# EAGLE board Debug Tester rev B (EAGLE 9.7.0)
REV: A
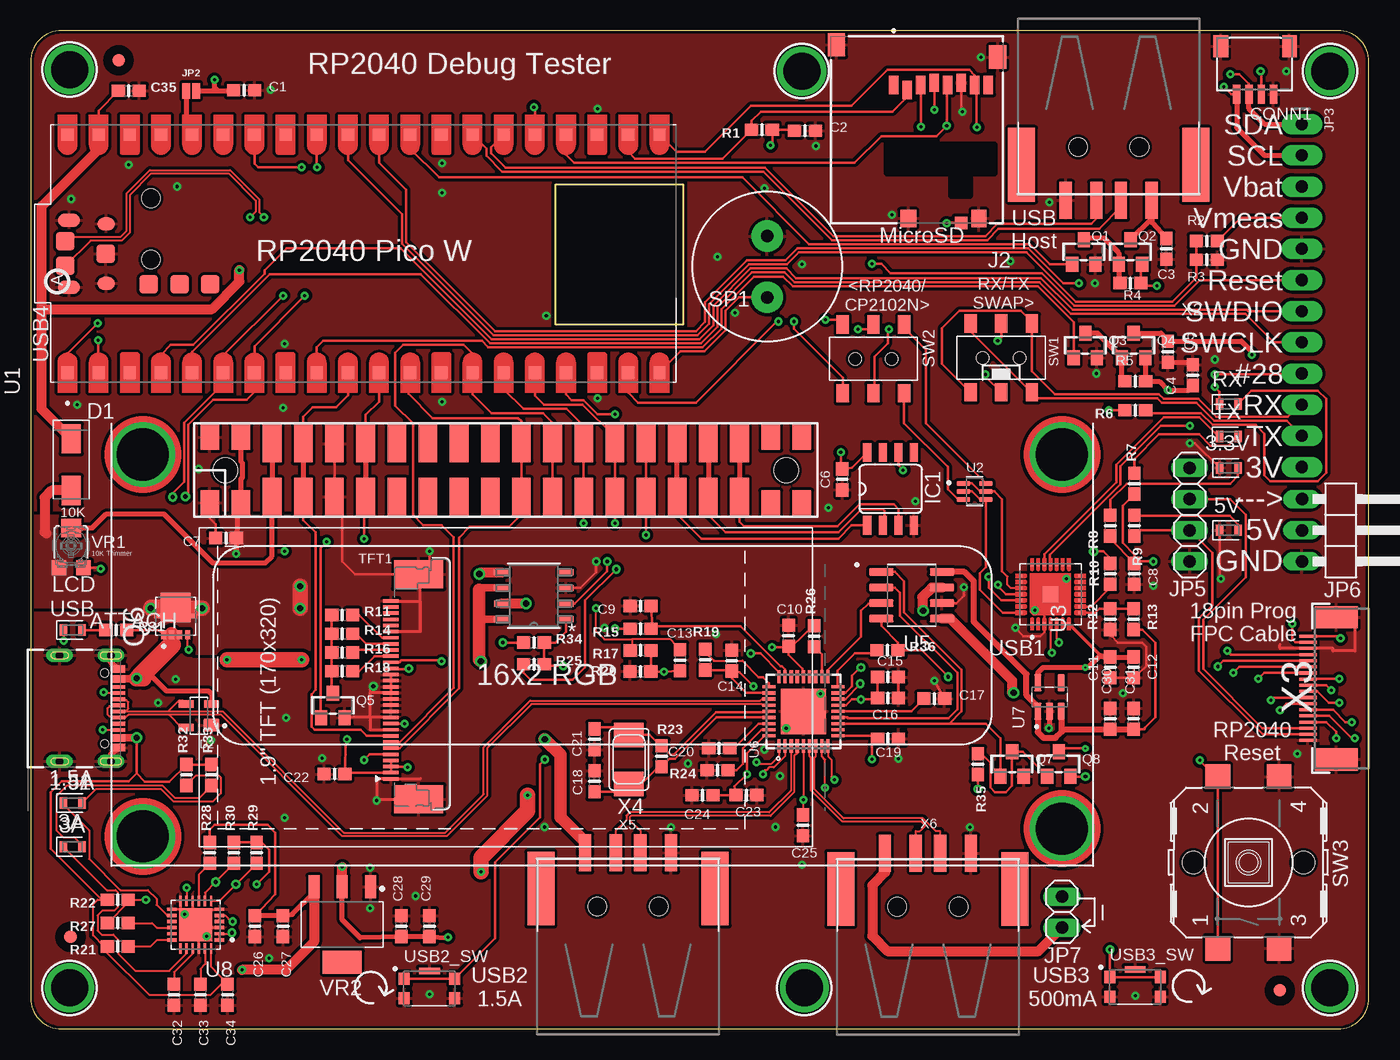
[diagram p2: board, top side]
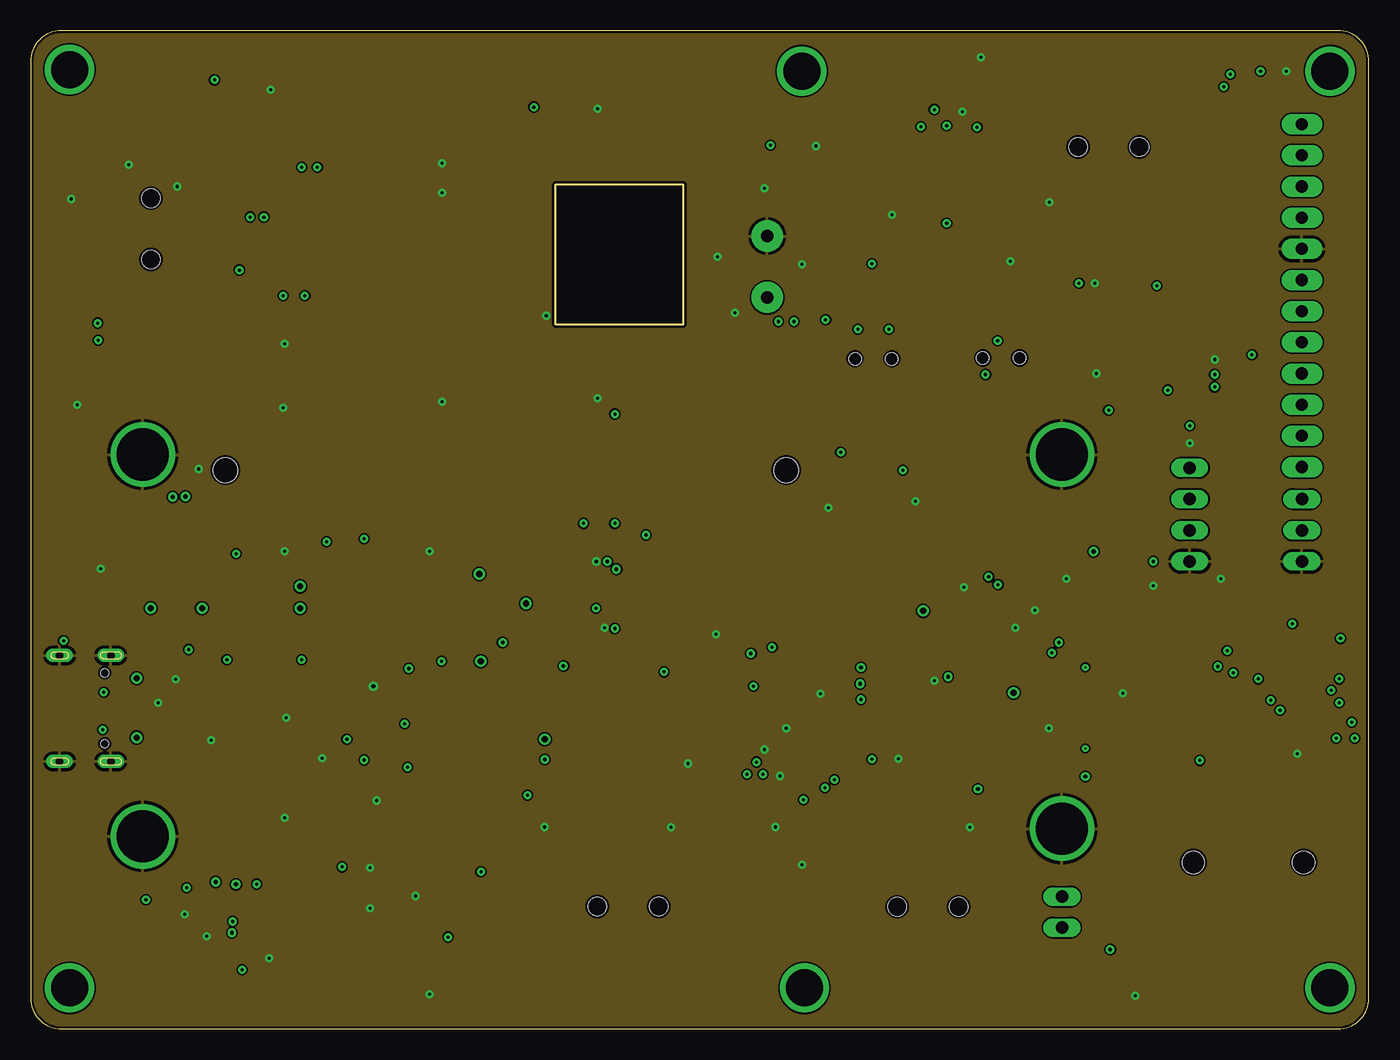
[diagram p3: board, inner layer Route2]
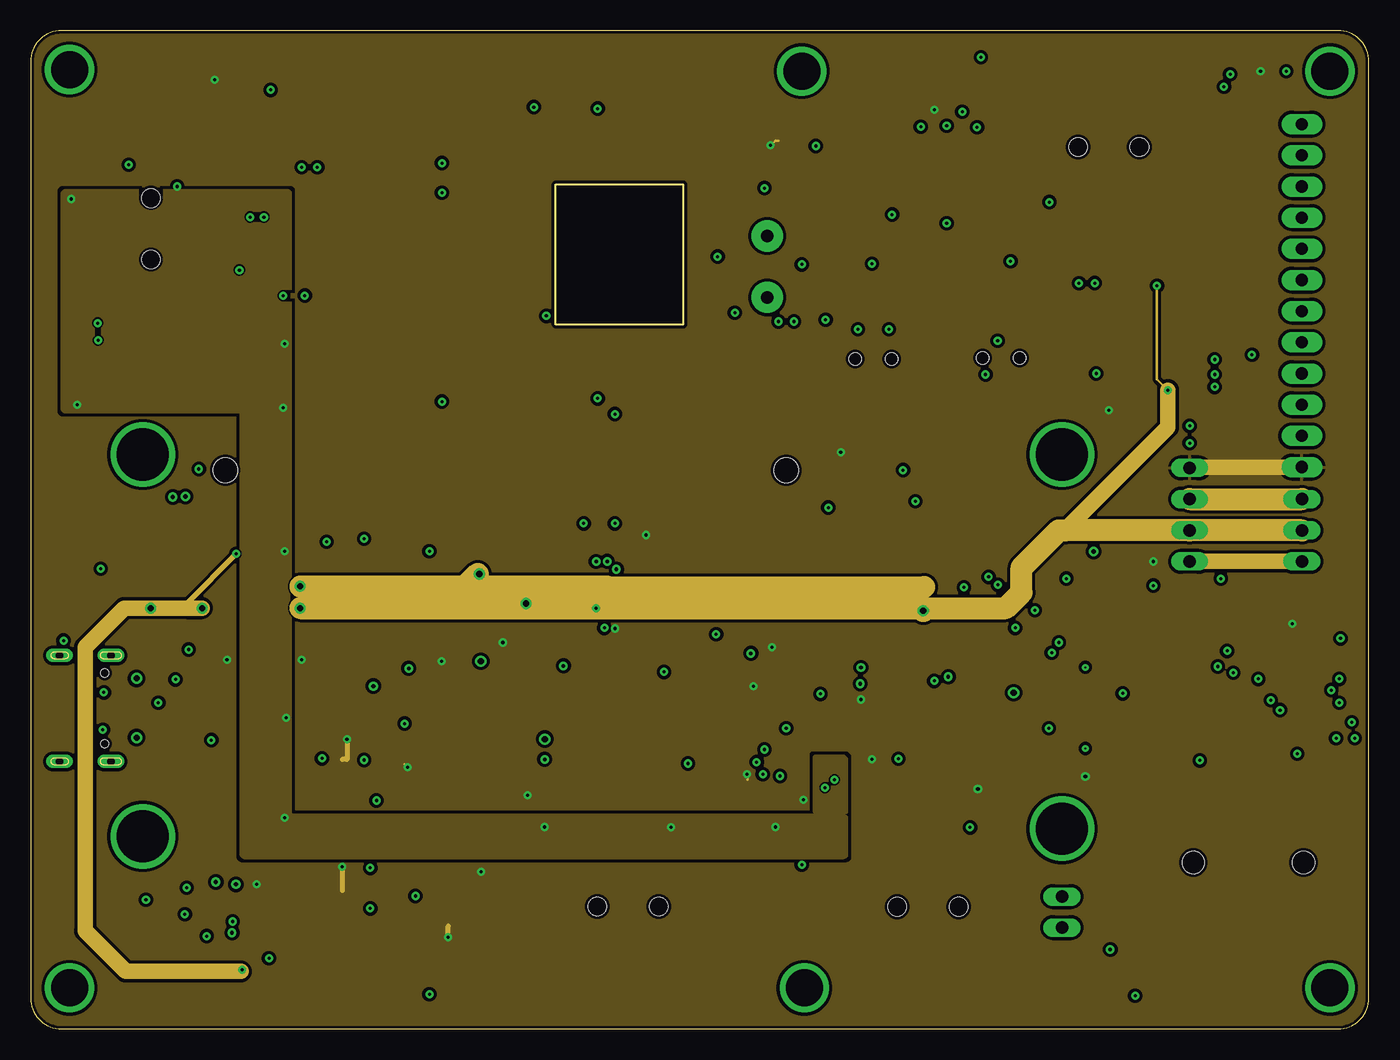
[diagram p4: board, inner layer Route15]
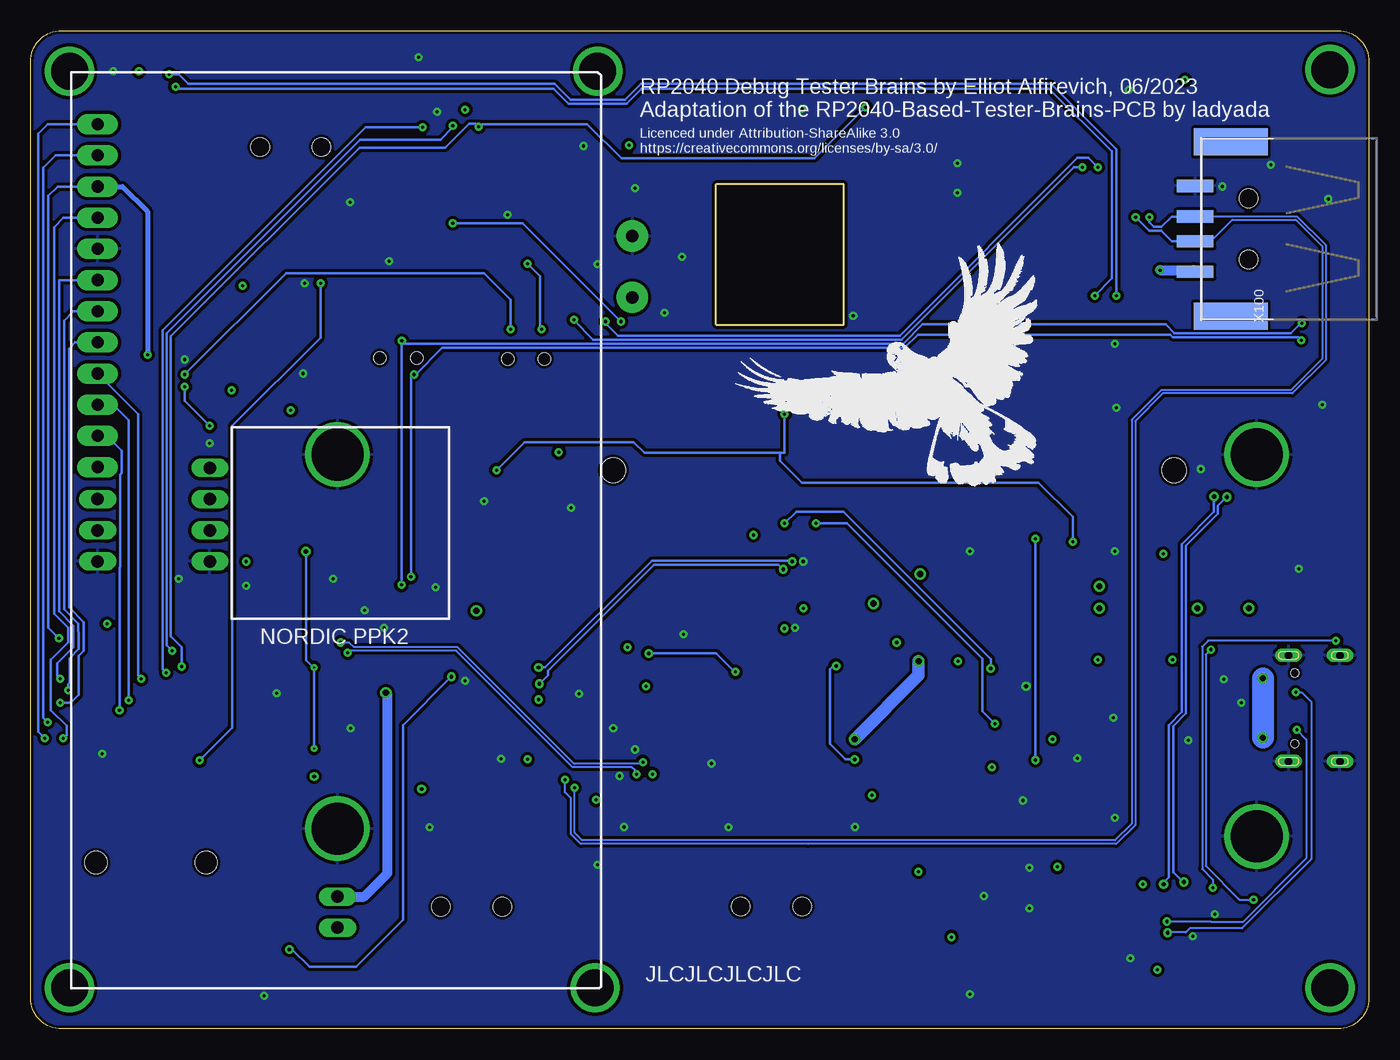
[diagram p5: board, bottom side, seen from below]

Size 109.09 x 81.35 mm. Coordinates in mm from the lower left corner, seen from the top.
Outline: 106.59,81.35 2.5,81.35 arc90 0,78.85 0,2.5 arc90 2.5,0 106.59,0 arc90 109.09,2.5 109.09,78.85 arc90 106.59,81.35
Outline: 53.21,57.4 42.8,57.4 42.8,68.83 53.21,68.83 53.21,57.4
Copper layers (1+2*15+16): Top 0.035mm / dielectric 1.5mm / Route2 0.035mm / dielectric 0.15mm / Route15 0.035mm / dielectric 0.2mm / Bottom 0.035mm
Design rules "adafruit 8-8 *": minimum track width 5mil, minimum drill 0.15mm, track to track 5mil, track to pad 0.2mm, pad to pad 0.2mm, via to via 0.2mm, smd to smd 0.2mm, copper to edge 0.2mm, drill to drill 0.5mm, minimum pad ring 10mil, minimum via ring 8mil, stop-mask expansion 2mil, vias tented up to drill 20mil, thermal gap 10mil
Net classes: 1 power: width 0.254 mm; 2 USB2: width 0.152 mm, clearance 0.127 mm

## Footprints (pad centres in the part's own frame; a part is rotated, then mirrored left to right if it is on the bottom)
LEDC1608X55N_FLAT-B = smd 0.612 x 0.912: A 0.75,0; C -0.75,0
MOUNTINGHOLE_3.0_PLATEDTHIN = drill 3 pad 3.6: P$1 0,0
0603-NO = smd 1.075 x 1: 1 -0.85,0; 2 0.85,0
JST_SH4 = smd 0.6 x 1.55: 1 -1.5,2.006; 2 -0.5,2.006; 3 0.5,2.006; 4 1.5,2.006 | smd 1.2 x 1.8: MT1 -2.8,-1.894; MT2 2.8,-1.894
DIOM5226X290N = smd 2.392 x 1.565: 1 -2.108,0; 2 2.108,0
SOT143 = smd 0.99 x 1.3: 1 -0.76,-1.025 | smd 0.59 x 1.3: 2 0.96,-1.025; 3 0.96,1.025; 4 -0.96,1.025
FIDUCIAL_1MM = smd 1 x 1: 1 0,0
SO08-SKINNYPADS = smd 0.66 x 1.524: 1 -1.905,-2.973; 2 -0.635,-2.973; 3 0.635,-2.973; 4 1.905,-2.973; 5 1.905,2.973; 6 0.635,2.973; 7 -0.635,2.973; 8 -1.905,2.973
GCT_USB4105_REVA = smd 0.6 x 1.15: A1/B12 -3.2,4.755; A4/B9 -2.4,4.755; B1/A12 3.2,4.755; B4/A9 2.4,4.755 | smd 0.3 x 1.15: A5 -1.25,4.755; A6 -0.25,4.755; A7 0.25,4.755; A8 1.25,4.755; B5 1.75,4.755; B6 0.75,4.755; B7 -0.75,4.755; B8 -1.75,4.755 | drill 0.6 pad 1 long: G1 -4.32,0; G2 4.32,0 | drill 0.6 pad 1.05 long: G3 -4.32,4.18; G4 4.32,4.18 | hole 0.65: 2.89,3.68; -2.89,3.68
GCT_MEM2052-00-195-00-A_REVA = smd 1.4 x 1.9: G1 -6.575,-5.925; G2 6.575,-6.925 | smd 1.2 x 1.4: G3 -5.035,7.225 | smd 1.3 x 1.4: G4 0.715,7.225 | smd 0.8 x 1.5: P1 1.905,-3.635; P2 0.805,-3.235; P3 -0.295,-3.635; P4 -1.395,-3.835; P5 -2.495,-3.635; P6 -3.595,-3.835; P7 -4.695,-3.635; P8 -5.795,-3.635 | smd 1 x 1.04: P9 -3.585,7.595
SMT-JUMPER_2_NO_NO-SILK = smd 0.635 x 1.27: 1 -0.406,0; 2 0.406,0
1X12_OVAL = drill 1 pad 1.676 long: 1 -13.97,0; 2 -11.43,0; 3 -8.89,0; 4 -6.35,0; 5 -3.81,0; 6 -1.27,0; 7 1.27,0; 8 3.81,0; 9 6.35,0; 10 8.89,0; 11 11.43,0; 12 13.97,0
2X20_SMT_MALE = smd 1.524 x 2.032: 1 -24.13,-2.667; 2 -24.13,2.667; 3 -21.59,-2.667; 4 -21.59,2.667; 37 21.59,-2.667; 38 21.59,2.667; 39 24.13,-2.667; 40 24.13,2.667 | smd 1.524 x 3.048: 5 -19.05,-2.159; 6 -19.05,2.159; 7 -16.51,-2.159; 8 -16.51,2.159; 9 -13.97,-2.159; 10 -13.97,2.159; 11 -11.43,-2.159; 12 -11.43,2.159; 13 -8.89,-2.159; 14 -8.89,2.159; 15 -6.35,-2.159; 16 -6.35,2.159; 17 -3.81,-2.159; 18 -3.81,2.159; 19 -1.27,-2.159; 20 -1.27,2.159; 21 1.27,-2.159; 22 1.27,2.159; 23 3.81,-2.159; 24 3.81,2.159; 25 6.35,-2.159; 26 6.35,2.159; 27 8.89,-2.159; 28 8.89,2.159; 29 11.43,-2.159; 30 11.43,2.159; 31 13.97,-2.159; 32 13.97,2.159; 33 16.51,-2.159; 34 16.51,2.159; 35 19.05,-2.159; 36 19.05,2.159 | hole 2: -22.86,0; 22.86,0
1X04 = drill 1.016 long: 1 -3.81,0; 2 -1.27,0; 3 1.27,0; 4 3.81,0
1X03/90 = drill 1.016 long: 1 -2.54,-3.81; 2 0,-3.81; 3 2.54,-3.81
1X02 = drill 1.016 long: 1 -1.27,0; 2 1.27,0
SOT23-WIDE = smd 1 x 1.2: 1 -0.95,-1; 2 0.95,-1; 3 0,1
TRANS_STL9P3LLH6 = smd 0.75 x 0.4: 1 -1.525,0.975; 2 -1.525,0.325; 3 -1.525,-0.325; 4 -1.525,-0.975 | smd 2.4 x 2.45: 5 0.7,0 | smd 0.4 x 0.53: 5_1 0,1.49; 5_2 0,-1.49
PS12 = drill 1 pad 2.54: P$1 -2.5,0; P$2 2.5,0
EG1390 = smd 1 x 1.5: O1 -2.5,2.8; O2 -2.5,-2.8; P1 0,2.8; P2 0,-2.8; S1 2.5,2.8; S2 2.5,-2.8 | hole 1: 1.5,0; -1.5,0
B3F-40XX-SMT = smd 2 x 2: P$1 -7,2.5; P$2 7,2.5; P$3 -7,-2.5; P$4 7,-2.5 | hole 1.803: 0,-4.496; 0,4.496
TFT_1.9IN_170X320_30P_SS = smd 0.28 x 1.25: 1 -7.25,1.236; 2 -6.75,1.236; 3 -6.25,1.236; 4 -5.75,1.236; 5 -5.25,1.236; 6 -4.75,1.236; 7 -4.25,1.236; 8 -3.75,1.236; 9 -3.25,1.236; 10 -2.75,1.236; 11 -2.25,1.236; 12 -1.75,1.236; 13 -1.25,1.236; 14 -0.75,1.236; 15 -0.25,1.236; 16 0.25,1.236; 17 0.75,1.236; 18 1.25,1.236; 19 1.75,1.236; 20 2.25,1.236; 21 2.75,1.236; 22 3.25,1.236; 23 3.75,1.236; 24 4.25,1.236; 25 4.75,1.236; 26 5.25,1.236; 27 5.75,1.236; 28 6.25,1.236; 29 6.75,1.236; 30 7.25,1.236 | smd 2.3 x 4: MNT1 -8.92,-1.02; MNT2 9.42,-1.02
SMT_NUT_3MM = drill 4.25 pad 4.572: P$1 0,0
MODULE_SC0915 = smd 1 x 1: 1 -9.69,24.13; 2 -9.69,21.59; 3 -9.69,19.05; 4 -9.69,16.51; 5 -9.69,13.97; 6 -9.69,11.43; 7 -9.69,8.89; 8 -9.69,6.35; 9 -9.69,3.81; 10 -9.69,1.27; 11 -9.69,-1.27; 12 -9.69,-3.81; 13 -9.69,-6.35; 14 -9.69,-8.89; 15 -9.69,-11.43; 16 -9.69,-13.97; 17 -9.69,-16.51; 18 -9.69,-19.05; 19 -9.69,-21.59; 20 -9.69,-24.13; 21 9.69,-24.13; 22 9.69,-21.59; 23 9.69,-19.05; 24 9.69,-16.51; 25 9.69,-13.97; 26 9.69,-11.43; 27 9.69,-8.89; 28 9.69,-6.35; 29 9.69,-3.81; 30 9.69,-1.27; 31 9.69,1.27; 32 9.69,3.81; 33 9.69,6.35; 34 9.69,8.89; 35 9.69,11.43; 36 9.69,13.97; 37 9.69,16.51; 38 9.69,19.05; 39 9.69,21.59; 40 9.69,24.13 | smd 1.1 x 1.8: A -2.725,24; B 2.725,24 | smd 1.05 x 1.45: C -2.425,20.97; D 2.425,20.97 | smd 1.5 x 1.5: TP1 0,21; TP2 1,24.3; TP3 -1,24.3; TP4 -2.5,17.5; TP5 -2.5,15; TP6 -2.5,12.5
SOP65P210X100-6N = smd 1.09 x 0.4: 1 -0.92,0.65; 2 -0.92,0; 3 -0.92,-0.65; 4 0.92,-0.65; 5 0.92,0; 6 0.92,0.65
IC_CP2102N-A02-GQFN28R = smd 0.25 x 0.25: 1 -2.4,1.5; 2 -2.4,1; 3 -2.4,0.5; 4 -2.4,0; 5 -2.4,-0.5; 6 -2.4,-1; 7 -2.4,-1.5; 8 -1.5,-2.4; 9 -1,-2.4; 10 -0.5,-2.4; 11 0,-2.4; 12 0.5,-2.4; 13 1,-2.4; 14 1.5,-2.4; 15 2.4,-1.5; 16 2.4,-1; 17 2.4,-0.5; 18 2.4,0; 19 2.4,0.5; 20 2.4,1; 21 2.4,1.5; 22 1.5,2.4; 23 1,2.4; 24 0.5,2.4; 25 0,2.4; 26 -0.5,2.4; 27 -1,2.4; 28 -1.5,2.4 | smd 1.27 x 1.27: 29 0,0
SOIC-8_M_MCH-L = smd 1.257 x 0.483: 1 -2.623,1.905; 2 -2.623,0.635; 3 -2.623,-0.635; 4 -2.623,-1.905; 5 2.623,-1.905; 6 2.623,-0.635; 7 2.623,0.635; 8 2.623,1.905
SOIC127P599X173-8N = smd 1.98 x 0.59: 1 -2.47,1.905; 2 -2.47,0.635; 3 -2.47,-0.635; 4 -2.47,-1.905; 5 2.47,-1.905; 6 2.47,-0.635; 7 2.47,0.635; 8 2.47,1.905
VQFN50P600X600X100-36N = smd 1.08 x 0.26: 1 -2.815,2; 2 -2.815,1.5; 3 -2.815,1; 4 -2.815,0.5; 5 -2.815,0; 6 -2.815,-0.5; 7 -2.815,-1; 8 -2.815,-1.5; 9 -2.815,-2; 19 2.815,-2; 20 2.815,-1.5; 21 2.815,-1; 22 2.815,-0.5; 23 2.815,0; 24 2.815,0.5; 25 2.815,1; 26 2.815,1.5; 27 2.815,2 | smd 0.26 x 1.08: 10 -2,-2.815; 11 -1.5,-2.815; 12 -1,-2.815; 13 -0.5,-2.815; 14 0,-2.815; 15 0.5,-2.815; 16 1,-2.815; 17 1.5,-2.815; 18 2,-2.815; 28 2,2.815; 29 1.5,2.815; 30 1,2.815; 31 0.5,2.815; 32 0,2.815; 33 -0.5,2.815; 34 -1,2.815; 35 -1.5,2.815; 36 -2,2.815 | smd 3.7 x 3.7: 37 0,0
SOT95P280X145-5N = smd 1.39 x 0.58: 1 -1.165,0.95; 2 -1.165,0; 3 -1.165,-0.95; 4 1.165,-0.95; 5 1.165,0.95
QFN50P400X400X100-25N = smd 0.84 x 0.26: 1 -1.93,1.25; 2 -1.93,0.75; 3 -1.93,0.25; 4 -1.93,-0.25; 5 -1.93,-0.75; 6 -1.93,-1.25; 13 1.93,-1.25; 14 1.93,-0.75; 15 1.93,-0.25; 16 1.93,0.25; 17 1.93,0.75; 18 1.93,1.25 | smd 0.26 x 0.84: 7 -1.25,-1.93; 8 -0.75,-1.93; 9 -0.25,-1.93; 10 0.25,-1.93; 11 0.75,-1.93; 12 1.25,-1.93; 19 1.25,1.93; 20 0.75,1.93; 21 0.25,1.93; 22 -0.25,1.93; 23 -0.75,1.93; 24 -1.25,1.93 | smd 2.7 x 2.7: 25 0,0
SW_KMR421GULCLFS = smd 0.9 x 1: 1 -2.05,0.8; 2 -2.05,-0.8; 3 2.05,-0.8; 4 2.05,0.8 | smd 1.7 x 0.55: 5 0,1.425
TRIMPOT_BOURNS_TC33X-2 = smd 1.2 x 1.2: 1 -1,-1.8; 3 1,-1.8 | smd 1.6 x 1.5: 2 0,1.45
SOT230P700X170-4 = smd 1.86 x 0.898: 1 -3.075,2.3; 2 -3.075,0; 3 -3.075,-2.3 | smd 1.86 x 3.189: 4 3.075,0
USB_HOST-SMT = smd 1 x 3: D+ 1,0.495; D- -1,0.495; GND 3.5,0.495; VBUS -3.5,0.495 | smd 2.2 x 6: MT1 -7.1,-2.413; MT2 7.1,-2.413 | hole 1.5: -2.5,-3.863; 2.5,-3.863
FPC_0.5MM_18PIN = smd 0.25 x 1.4: 1 4.25,1.154; 2 3.75,1.154; 3 3.25,1.154; 4 2.75,1.154; 5 2.25,1.154; 6 1.75,1.154; 7 1.25,1.154; 8 0.75,1.154; 9 0.25,1.154; 10 -0.25,1.154; 11 -0.75,1.154; 12 -1.25,1.154; 13 -1.75,1.154; 14 -2.25,1.154; 15 -2.75,1.154; 16 -3.25,1.154; 17 -3.75,1.154; 18 -4.25,1.154 | smd 1.8 x 3.5: SUPPORT1 -5.8,-1.152; SUPPORT2 5.8,-1.152
NX5032 = smd 2 x 2.4: P$1 2,0; P$2 -2,0

## Placement (x,y rotation side)
1.5A  LED_BLUE  [LEDC1608X55N_FLAT-B]  3.43,18.41 0 top
3.3V  LED_BLUE  [LEDC1608X55N_FLAT-B]  97.68,45.71 0 top
3A  LED_BLUE  [LEDC1608X55N_FLAT-B]  3.42,14.85 0 top
5V  LED_BLUE  [LEDC1608X55N_FLAT-B]  97.68,40.63 0 top
$$U$1  MOUNTINGHOLE3.0THIN  [MOUNTINGHOLE_3.0_PLATEDTHIN]  3.17,78.18 0 top
$$U$2  MOUNTINGHOLE3.0THIN  [MOUNTINGHOLE_3.0_PLATEDTHIN]  62.87,78.05 0 top
$$U$3  MOUNTINGHOLE3.0THIN  [MOUNTINGHOLE_3.0_PLATEDTHIN]  105.92,78.05 0 top
$$U$4  [PCBFEAT-REV-040]  2.16,60.9 90 top
$$U$5  MOUNTINGHOLE3.0THIN  [MOUNTINGHOLE_3.0_PLATEDTHIN]  3.17,3.35 0 top
$$U$6  MOUNTINGHOLE3.0THIN  [MOUNTINGHOLE_3.0_PLATEDTHIN]  63.08,3.35 0 top
ATTACH  LED_BLUE  [LEDC1608X55N_FLAT-B]  3.43,32.5 0 top
C1  10uF  [0603-NO]  17.4,76.5 0 top
C2  10uF  [0603-NO]  63.12,73.19 0 top
C3  10uF  [0603-NO]  92.58,63.57 270 top
C4  10uF  [0603-NO]  92.71,55.19 270 top
C5  10uF  [0603-NO]  94.74,53.28 90 top
C6  10uF  [0603-NO]  66.17,44.77 270 top
C7  10uF  [0603-NO]  15.92,40 180 top
C8  10uF  [0603-NO]  89.97,37.08 270 top
C9  0.1uF  [0603-NO]  49.73,34.46 180 top
C10  0.1uF  [0603-NO]  61.79,32.05 90 top
C11  0.1uF  [0603-NO]  88.01,29.46 270 top
C12  10uF  [0603-NO]  89.92,29.46 270 top
C13  1uF  [0603-NO]  52.93,30.04 270 top
C14  0.1uF  [0603-NO]  57.16,30.01 90 top
C15  0.1uF  [0603-NO]  69.9,28.67 0 top
C16  4.7uF  [0603-NO]  69.9,26.97 0 top
C17  0.1uF  [0603-NO]  73.66,26.92 0 top
C18  12pf  [0603-NO]  45.97,23.59 270 top
C19  0.1uF  [0603-NO]  69.9,23.65 0 top
C20  0.1uF  [0603-NO]  56.13,22.86 180 top
C21  12pf  [0603-NO]  45.97,20.18 90 top
C22  10uF  [0603-NO]  24.77,20.77 180 top
C23  0.1uF  [0603-NO]  58.34,19.05 0 top
C24  4.7uF  [0603-NO]  54.78,19.03 180 top
C25  0.1uF  [0603-NO]  62.95,16.58 270 top
C26  4.7uF  [0603-NO]  18.29,8.37 270 top
C27  1uF  [0603-NO]  20.57,8.37 270 top
C28  10uF  [0603-NO]  30.23,8.37 90 top
C29  1uF  [0603-NO]  32.51,8.37 90 top
C30  0.1uF  [0603-NO]  88.01,25.27 90 top
C31  10uF  [0603-NO]  89.92,25.27 90 top
C32  1uF  [0603-NO]  11.68,2.79 270 top
C33  1uF  [0603-NO]  13.84,2.79 270 top
C34  1uF  [0603-NO]  16.05,2.79 270 top
C35  10uF  [0603-NO]  8,76.45 0 top
CONN1  STEMMA_I2C_QT  [JST_SH4]  99.82,78.18 180 top
D1  B140  [DIOM5226X290N]  3.3,45.99 270 top
D2  SP0503BAHTG  [SOT143]  13.72,25.52 90 top
FID1  FIDUCIAL_1MM  [FIDUCIAL_1MM]  7.16,78.94 0 top
FID2  FIDUCIAL_1MM  [FIDUCIAL_1MM]  3.25,7.5 0 top
FID3  FIDUCIAL_1MM  [FIDUCIAL_1MM]  101.84,3.13 0 top
IC1  WS2811-SOP8  [SO08-SKINNYPADS]  70.1,44.01 0 top
J1  USB4105_REVA  [GCT_USB4105_REVA]  2.36,26.12 270 top
J2  MEM2052-00-195-00-A_REVA  [GCT_MEM2052-00-195-00-A_REVA]  72.26,73.28 180 top
JP2  JUMPER-SMT_2_NC_PASTE_NO-SILK  [SMT-JUMPER_2_NO_NO-SILK]  13.08,76.45 0 top
JP3  [1X12_OVAL]  103.63,59.76 270 top
JP4  16x2 LCD  [2X20_SMT_MALE]  38.73,45.54 0 top
JP5  PINHD-1X4  [1X04]  94.49,41.9 90 top
JP6  PINHD-1X3/90  [1X03/90]  107.44,40.63 270 top
JP7  PINHD-1X2  [1X02]  84.07,9.52 270 top
Q1  BSS138  [SOT23-WIDE]  85.85,63.32 0 top
Q2  DMG34x5  [SOT23-WIDE]  89.66,63.32 0 top
Q3  BSS138  [SOT23-WIDE]  85.98,55.7 0 top
Q4  DMG34x5  [SOT23-WIDE]  89.92,55.7 0 top
Q5  BSS138  [SOT23-WIDE]  24.64,26.36 0 top
Q6  STL9P3LLH6  [TRANS_STL9P3LLH6]  11.81,33.65 90 top
Q7  BSS138  [SOT23-WIDE]  80.01,21.58 0 top
Q8  DMG34x5  [SOT23-WIDE]  83.82,21.58 0 top
R1  10K  [0603-NO]  59.61,73.27 180 top
R2  10K  [0603-NO]  95.89,64.2 0 top
R3  10K  [0603-NO]  95.89,62.68 180 top
R4  10K  [0603-NO]  89.66,60.78 0 top
R5  10K  [0603-NO]  90.04,52.77 0 top
R6  22K  [0603-NO]  90.04,50.41 180 top
R7  22K  [0603-NO]  89.97,44.44 270 top
R8  22K  [0603-NO]  88.01,41.01 270 top
R9  47K  [0603-NO]  89.97,41.01 270 top
R10  1K  [0603-NO]  88.01,37.08 90 top
R11  27  [0603-NO]  25.4,33.72 0 top
R12  47K  [0603-NO]  88.01,33.39 90 top
R13  22K  [0603-NO]  89.92,33.39 270 top
R14  27  [0603-NO]  25.4,32.2 0 top
R15  100K  [0603-NO]  49.73,32.61 180 top
R16  27  [0603-NO]  25.4,30.68 0 top
R17  100K  [0603-NO]  49.73,30.85 180 top
R18  27  [0603-NO]  25.4,29.15 0 top
R19  100K  [0603-NO]  54.99,30.09 90 top
R20  100K  [0603-NO]  49.71,29.13 0 top
R21  1K  [0603-NO]  7.11,6.72 180 top
R22  100K  [0603-NO]  7.11,10.53 180 top
R23  1M  [0603-NO]  51.43,22.22 270 top
R24  12K  [0603-NO]  56.01,21.07 180 top
R25  1K  [0603-NO]  41.02,29.71 0 top
R26  100K  [0603-NO]  63.88,32 90 top
R27  20K  [0603-NO]  7.11,8.63 180 top
R28  1K  [0603-NO]  14.61,14.34 90 top
R29  10K  [0603-NO]  18.41,14.34 90 top
R30  10K  [0603-NO]  16.57,14.34 90 top
R31  47K  [0603-NO]  6.99,32.5 0 top
R32  47K  [0603-NO]  12.7,20.69 90 top
R33  47K  [0603-NO]  14.73,20.69 90 top
R34  1K  [0603-NO]  41.02,31.49 0 top
R35  10K  [0603-NO]  77.22,21.58 270 top
R36  1K  [0603-NO]  69.85,30.85 0 top
RX  LED_BLUE  [LEDC1608X55N_FLAT-B]  97.66,50.92 0 top
SP1  SPEAKER/PS12  [PS12]  60.04,62.11 270 top
SW1  DPDT SLIDE  [EG1390]  79.12,54.68 180 top
SW2  [EG1390]  68.71,54.6 0 top
SW3  12mm SMT  [B3F-40XX-SMT]  99.28,13.56 90 top
TFT1  DISP_LCD_ST7789_1.9IN_SS  [TFT_1.9IN_170X320_30P_SS]  30.61,27.63 90 top
TP1  SEWTAP_SMTNUTM3  [SMT_NUT_3MM]  9.14,46.81 0 top
TP2  SEWTAP_SMTNUTM3  [SMT_NUT_3MM]  84.08,46.81 0 top
TP3  SEWTAP_SMTNUTM3  [SMT_NUT_3MM]  84.08,16.32 0 top
TP4  SEWTAP_SMTNUTM3  [SMT_NUT_3MM]  9.14,15.69 0 top
TX  LED_BLUE  [LEDC1608X55N_FLAT-B]  97.66,48.27 0 top
U1  SC0915  [MODULE_SC0915]  27.13,63.18 90 top
U2  UMH3NTN  [SOP65P210X100-6N]  76.96,43.81 0 top
U3  CP2102N-A02-GQFN28R  [IC_CP2102N-A02-GQFN28R]  83.14,35.42 90 top
U4  MIC2505-1YM-TRSOIC-8_M_MCH-L  [SOIC-8_M_MCH-L]  41.02,35.3 180 top
U5  MIC2026-1YM  [SOIC127P599X173-8N]  71.82,35.34 0 top
U6  USB2514B-AEZG  [VQFN50P600X600X100-36N]  63,25.88 90 top
U7  MIC5504-3.3YM5_TR  [SOT95P280X145-5N]  83.06,27.04 90 top
U8  STUSB4500LQTR  [QFN50P400X400X100-25N]  13.46,8.5 180 top
U$7  MOUNTINGHOLE3.0THIN  [MOUNTINGHOLE_3.0_PLATEDTHIN]  105.92,3.35 0 top
USB2_SW  KMR421GULCLFS  [SW_KMR421GULCLFS]  32.51,3.29 0 top
USB3_SW  KMR421GULCLFS  [SW_KMR421GULCLFS]  90.04,3.42 0 top
VR1  10K Trimmer  [TRIMPOT_BOURNS_TC33X-2]  3.3,39.38 0 top
VR2  NCP1117ST33T3G  [SOT230P700X170-4]  25.4,8.5 270 top
X2  USB A  [USB_HOST-SMT]  87.88,68.02 180 top
X3  TESTER_PROGCABLE_FLIP  [FPC_0.5MM_18PIN]  105.28,27.76 90 top
X4  24MHZ  [NX5032]  48.77,21.96 270 top
X5  USB A  [USB_HOST-SMT]  48.7,13.85 0 top
X6  USB A  [USB_HOST-SMT]  73.15,13.82 0 top
X100  USB A  [USB_HOST-SMT]  13.67,65.2 90 bottom

## Tracks (layer width: path | path; a pad name or v marks a point on that pad's centre or on a via)
3.3-RP2040
  Top 0.406: JP2.1 12.68,74.26 12.57,74.16 12.57,73.46 U1.36
3.3V  (via drill 0.25, 0.3)
  Top 0.152: U6.5 v63,18.66 62.95,18.61 C25.1
  Top 0.203: TFT1.4 TFT1.3 | TFT1.3 TFT1.2 25.82,20.88 C22.1 25.72,23.68 v25.78,23.61 | TFT1.3 30.68,21.38 v30.73,21.33 | TFT1.20 30.06,29.88 30.22,30.03 33.42,30.03 v33.49,29.96 | C15.1 C16.1 68.82,26.85 v67.69,26.85 66.94,26.85 66.48,26.38 U6.15 | U6.10 68.72,23.88 C19.1 68.58,23.18 v68.58,21.96 | U6.36 59.83,23.88 58.39,22.44 v58.39,20.77 57.39,19.77 C23.1 57.37,19.03 C24.1 | U6.29 58.33,27.38 57.16,28.56 C14.1 | v58.93,27.93 57.8,29.06 C14.1 | C10.1 61.79,30.5 62.93,29.36 62.93,28.76 U6.23 | C10.1 61.78,31.11 v60.45,31.11 | C2.1 62.19,73.27 R1.1 60.46,72.14 v60.32,72 | 73.67,74.94 v73.66,74.92 J2.P4 | CONN1.2 100.32,77.96 100.33,77.97 v100.27,78.03 | IC1.8 66.94,45.72 C6.1 66.04,45.85 v66.04,46.98 | X3.2 103.11,31.51 102.87,31.74 v102.87,33.01 | JP4.30 JP4.29 v50.16,40.25 | R15.2 47.65,32.61 v47.62,32.63 | R6.2 v87.88,50.41 | R8.2 88.01,39.98 C8.1 89.97,38.09 | R7.2 89.03,42.65 89.03,39.6 89.97,38.66 89.97,38.09 | v91.53,38.09 89.97,38.09 | R19.1 57.16,29.24 C14.1 | v18.41,11.8 19.43,12.82 19.43,14.6 18.84,15.19 R29.2 R30.2 | v77.22,19.55 R35.2 | v85.98,20.57 84.79,20.57 Q8.2 | v38.48,31.49 R34.1 | R26.2 63.8,32.85 62.05,31.2 C10.1
  Top 0.406: VR2.2 25.4,8.88 26.86,7.42 C28.1 C29.1 34.04,7.42 v34.04,7.49 | JP2.2 15.24,76.45 | 15.24,76.45 16.4,76.45 C1.1 | 15.24,76.45 14.99,76.7 v14.99,77.34
  Top 0.813: VR2.2 v25.4,13.2
  Top 1.27: v40.51,19.04 40.51,17.77 36.7,13.96 v36.7,12.82 | v22.1,30.09 v16,30.09
  Route15 0.203: v30.73,21.33 30.48,21.58 | v58.39,20.77 58.42,20.74 58.42,20.31 | v60.32,72 60.71,72.38 60.96,72.38
  Route15 0.406: v34.04,7.49 34.04,8.37 | v25.78,23.61 25.78,21.96 25.4,21.96 | v25.4,13.2 25.4,11.3
  Route15 1.27: JP5.4 94.57,45.79 JP3.12
  pour Route15 (isolate 0.254, rank 2): 0.13,0.12 109.09,0.12 109.09,81.15 0.13,81.15
3V_CP  (via drill 0.15, 0.35)
  Top 0.203: Q8.3 84.09,22.85 v85.98,22.85 | R10.2 88.01,38.36 87.46,38.91 v86.65,38.91
  Top 0.305: 87.26,30.41 U3.7 U3.6
  Top 0.406: C12.1 C11.1 87.26,30.41 | U7.5 82.11,29.01 82.55,29.46 v85.98,29.46 86.23,29.46 87.18,30.41
  Top 0.508: 87.18,30.41 C11.1
  Bottom 0.203: 85.98,29.39 v85.98,22.85 | 85.98,29.39 v85.98,29.46 | v86.65,38.91 86.65,30.06 85.98,29.39
!VBAT_SW1
  Top 0.406: R5.1 88.97,53 Q4.1 86.97,56.7 Q3.3
!VBAT_SW2
  Top 0.406: R4.1 88.71,60.88 Q2.1 88.71,63.25 87.52,64.44 85.98,64.44 Q1.3
+5V  (via drill 0.25, 0.5)
  Top 0.152: C13.1 52.18,31.74 49.02,31.74 | 49.02,31.74 49.02,30.98 R17.2 | 49.02,31.74 46.77,31.74 46.07,32.44 46.07,34.25 v46.1,34.28
  Top 0.203: v91.82,60.57 90.72,60.57 R4.2 90.51,62.22 Q2.2 | X3.17 100.45,24.01 95.25,29.2 95.25,33.48 96.31,34.54 96.31,38.81 JP5.2 90.44,40.63 R9.2 | C26.1 19.94,10.98 19.94,15.99 19.3,16.63 14.99,16.63 14.61,16.25 R28.2 | v17.23,4.82
  Top 0.406: JP4.4 17.14,46.25 17.28,46.12 17.28,44.95 17.14,44.82 JP4.3 16.87,42.6 C7.1 16.87,39.85 16.76,39.74 v16.76,38.73 | C5.1 94.47,52.06 v92.71,52.06 92,52.77 R5.2 90.89,54.67 Q4.2 | VR2.3 23.1,11.1 21.33,9.32 C27.1 C26.1
  Top 0.61: 36.7,37.2 v36.58,37.08
  Top 0.813: VR2.3 23.1,7.09 20.83,4.82 v17.23,4.82 | D1.2 1.73,43.88 1.14,43.3 1.14,40.5 1.27,40.38 | 36.7,37.2 U4.5 | v40.39,34.66 U4.7 | U5.7 73.46,35.97 72.7,35.2 72.7,34.2 72.76,34.13 v72.76,34.07
  Top 1.27: v21.97,36.06 v21.97,34.28 | v9.78,34.28 9.84,34.35 Q6.5 11.88,34.28 v13.97,34.28
  Route15 0.203: v92.71,52.06 91.82,52.95 v91.82,60.57 | 87.06,40.57 94.42,40.57 JP5.2 | v17.23,4.82 17.23,4.78 17.14,4.69
  Route15 0.406: v16.76,38.73 12.7,34.66 12.7,34.28
  Route15 0.61: v40.39,34.66 40.64,34.41 40.64,34.28
  Route15 1.27: v13.97,34.28 12.7,34.28 7.62,34.28 4.45,31.11 4.45,7.99 7.75,4.69 17.14,4.69 | v92.71,52.06 92.71,49.01 84.33,40.63 | 36.45,37.08 v36.58,37.08
  Route15 1.778: v21.97,34.28 40.64,34.28 v46.1,34.28 73.02,34.28 | 73.02,34.28 79.5,34.28 80.77,35.55 80.77,37.58 83.82,40.63 84.33,40.63 JP5.2 JP6.2 | v21.97,36.06 35.43,36.06 | 36.45,37.08 35.43,36.06 | 35.43,36.06 46.98,36.06 47.04,36 72.83,36 | 73.02,34.28 72.81,34.07 v72.76,34.07
  pour Top (isolate 0.254, no thermals): 9,33.08 9.02,33.04 9.02,31.79 10.21,30.6 22.73,30.6 22.73,41.77 0.13,41.77 0.13,34.41 7.65,34.41 7.69,34.39
BOOT-CP
  Top 0.203: U2.3 75.58,43.16 74.76,43.98 74.76,45.82 71.21,49.37 SW2.S2
CC1  (via drill 0.25, 0.3)
  Top 0.152: J1.A5 6.02,27.37 v5.97,27.42 | U8.2 15.44,7.71 16.29,7.71 v16.41,7.83
  Top 0.203: U8.2 U8.1
  Bottom 0.152: v5.97,27.42 5.46,27.42 4.7,26.66 4.7,13.84 10.34,8.19 14.61,8.19 14.94,7.87 16.38,7.87 v16.41,7.83
CC2  (via drill 0.25)
  Top 0.152: U8.4 U8.5 15.84,9.25 16.34,8.75 v16.47,8.75 | v5.88,24.37 J1.B5
  Bottom 0.152: v5.88,24.37 5.09,23.57 5.09,13.92 10.29,8.71 12.83,8.71 12.87,8.75 v16.47,8.75
D_N
  Top 0.152: 7.62,25.87 J1.A7 | 7.62,25.87 8.43,25.87 11.19,25.87 | U6.30 60.15,26.91 59.66,26.91 59.5,26.75 59.47,26.75 | 59.47,26.75 | J1.B7 7.19,26.8 7.81,26.8 7.97,26.64 7.97,26.11 7.81,25.95 7.62,25.95 7.62,25.87 | 11.19,25.87 15.65,25.87 25.53,15.99 33.79,15.99 36.93,19.13 36.93,22.97 40.72,26.75 59.47,26.75 | D2.3 12.44,26.73 12.06,26.73 11.19,25.87
D_P
  Top 0.152: U6.31 59.68,26.38 59.58,26.47 40.83,26.47 37.21,22.85 37.21,19.02 33.91,15.72 25.41,15.72 15.54,25.59 11.28,25.59 | J1.A6 7.12,26.3 6.43,26.3 6.27,26.14 6.27,25.61 6.43,25.45 7.12,25.45 J1.B6 7.72,25.37 7.79,25.45 7.81,25.45 7.95,25.59 11.28,25.59 | D2.4 12.31,24.56 11.28,25.59
DTR
  Top 0.203: U2.2 76.75,43.81 77.4,43.16 U2.4 77.88,37.61 77.39,37.12 77.39,35.79 79.27,33.92 U3.28
EN1
  Top 0.203: U6.12 74.67,24.88 74.89,24.88 | Q7.1 79.06,23.68 77.86,24.88 74.89,24.88 | 74.89,24.88 75.89,25.88 75.89,29.25 71.2,33.95 71.2,36.49 70.45,37.24 U5.1
EN2  (via drill 0.3)
  Top 0.203: U4.1 43.64,32.38 42.75,31.49 R34.2 R25.2 42,29.58 v43.43,29.58 | v41.91,21.96 41.53,21.58 41.53,17.26 37.85,13.58 37.85,7.38 USB2_SW.4 USB2_SW.1
  Bottom 0.203: v41.91,21.96 42.67,21.96 43.94,23.23 43.94,29.33 43.56,29.71 v43.43,29.58
EN3  (via drill 0.3)
  Top 0.203: U5.4 69.35,32.84 70.7,31.49 R36.2 72.64,30.85 v74.8,28.69 | v88.01,6.47 87.99,6.45 USB3_SW.1 USB3_SW.4
  Bottom 0.203: v74.8,28.69 78.74,24.76 78.74,8.88 82.55,5.07 86.36,5.07 87.76,6.47 v88.01,6.47
EN4
  Top 0.203: U6.20 64.5,30.53 R26.1
GND  (via drill 0.25, 0.3, 0.35)
  Top 0.203: TFT1.18 TFT1.17 TFT1.16 TFT1.15 | R12.1 88.14,32.42 88.14,32 88.65,31.49 90.63,31.49 90.97,31.15 90.97,29.56 C12.2 C11.2 | U3.29 83.14,34.75 82.64,34.25 U3.3 82.64,32.34 82.3,32 80.94,32 v80.26,32.68 | JP4.10 JP4.9 25.4,42.74 25.4,38.09 26.44,37.05 TFT1.MNT2 32.51,37.93 v32.51,38.93 | U6.37 62.51,25.39 62.23,25.39 61.59,24.76 v61.59,24.5 | C16.2 C15.2 | 5V.C 96.93,36.8 v97.03,36.7 | 3.3V.C 94.89,47.74 v94.49,47.74 | U8.13 12.16,9.75 v12.57,9.34 | U8.12 12.21,9.7 v12.57,9.34 | U8.3 15.37,8.23 14.67,8.23 14.67,7.88 v14.35,7.56 14.08,7.29 13.71,7.29 U8.22 | v12.57,9.34 12.7,9.34 | 12.7,9.34 12.85,9.34 | 12.85,9.34 14.53,9.34 14.89,9.71 14.95,9.71 14.99,9.75 U8.6 | JP4.1 14.61,41.6 15.09,41.12 15.07,41.12 C7.2 | 27.69,27.38 27.69,27.68 v27.94,27.93 | VR1.3 5.64,37.57 v5.71,37.5 | U8.25 12.7,9.26 12.7,9.34 | U8.10 | U8.10 13.21,9.7 12.85,9.34 | U5.6 75.48,34.7 76.07,35.3 v76.07,35.98 | U4.3 44.83,35.93 46.1,37.2 v46.1,38.09 | v73.66,28.36 C17.2 | J2.P6 75.86,74.83 v75.95,74.75
  Top 0.254: TFT1.11 27.69,25.38 | 27.69,25.38 25.59,25.38 Q5.2 | TFT1.9 27.69,24.38 27.69,25.38 | TFT1.15 27.69,27.38 27.69,25.38 | TFT1.30 29.37,34.87 31.75,34.87 | 31.75,34.87 31.75,37.05 TFT1.MNT2 | TFT1.25 31.75,32.38 31.75,34.87 | 101.85,31.31 101.85,31.01 X3.3 106.17,31.01 106.17,30.8 107.95,30.8 107.95,33.56 X3.SUPPORT2 | TFT1.MNT1 28.19,18.71 28.19,20.39 28.45,20.39 28.45,20.38 TFT1.1 31.75,20.39
  Top 0.406: C4.2 94.54,54.34 C5.2 | U7.2 83.06,24.55 v83.01,24.5
  Top 0.508: J1.A1/B12 6.54,29.9 J1.G3 | J1.B1/A12 6.54,22.35 J1.G4
  Route15 1.27: JP5.1 JP6.3
  other vias: 83.06,67.38 86.74,60.78 102.36,78.05 72.14,43 65.02,42.49 28.19,18.61 13.71,45.63 86.87,53.41 103.26,22.42 14.73,23.53 19.43,5.75 31.37,10.83 27.69,13.12 27.69,9.82 11.81,28.48 52.2,16.42 76.58,16.42 70.74,22.01 53.59,21.63 61.09,20.61 55.88,32.17 89.03,27.34 59.82,22.77 11.94,68.65 62.86,13.37 96.52,54.55 19.56,76.52 8,70.43 33.53,70.56 46.23,75 46.23,51.38 33.53,51.12 20.7,55.82 64.01,71.95 60.71,16.45 41.91,16.45 20.7,17.21 20.83,25.34 20.7,38.93 20.57,50.62 3.81,50.87 3.3,67.63 56.01,62.93 64.39,27.3 33.53,68.14 42.04,58.11 59.82,68.52 62.86,62.3 57.4,58.36 79.88,62.55 81.86,34.13 84.44,36.7 91.53,36.13 23.75,22.04 32.51,2.83 90.04,2.7 46.77,32.68 77.47,79.19 70.23,66.36 10.41,26.58
  pour Top (isolate 0.254, rank 2): 0,0.12 109.22,0.12 109.22,81.35 0,81.35
  pour Bottom (isolate 0.254): 0,0.13 109.22,0.13 109.22,81.35 0,81.35
  pour Route2: 0.08,0.07 109.14,0.07 109.14,81.2 0.08,81.2
  pour Route15: 2.82,68.04 2.82,50.56 17.07,50.56 17.17,50.54 17.27,50.48 17.34,50.41 17.4,50.31 17.42,50.21 17.42,14.24 66.27,14.24 66.27,17.11 21.28,17.11 21.18,17.14 21.09,17.19 21.01,17.27 20.96,17.36 20.93,17.46 20.93,68.04
  pour Route15: 63.96,17.72 66.47,17.72 66.47,21.94 66.27,22.14 63.96,22.14
GPIO28  (via drill 0.25)
  Top 0.203: v100.08,28.52 100.57,29.01 X3.7 | JP3.9 103.55,53.33 v96.52,53.33 | SW2.P2 68.71,52.44 68.77,52.5 68.77,54.77 69.89,55.89 69.89,56.93 v69.98,57.02
  Bottom 0.203: JP3.9 100.33,50.11 100.33,28.76 v100.08,28.52 | v96.52,53.33 88.27,61.59 72.14,61.59 69.98,59.43 v69.98,57.02
GPIO28-RP2040  (via drill 0.25)
  Top 0.203: SW2.O2 66.21,53.07 62.23,57.05 v62.23,57.65 | U1.34 18.24,70.52 18.54,70.22 v22.1,70.22
  Bottom 0.203: v22.1,70.22 22.86,70.98 23.75,70.98 38.23,56.51 61.21,56.51 62.23,57.52 v62.23,57.65
LCD_BLUE
  Top 0.203: JP4.35 57.78,41.34 58.17,40.96 65.79,40.96 67.56,42.74 70.36,42.74 70.74,42.36 IC1.3
  Top 0.406: JP4.36 JP4.35
LCD_D4
  Top 0.203: TFT1.6 30.06,22.88 34.92,27.74 34.92,36.82 34.92,40.04 35.8,40.92 38.99,40.92 40.05,41.98 40.05,43.33 JP4.21 JP4.22 40,49.52 39.75,49.78 32.77,49.78 30.8,51.74 30.81,51.76 30.81,53.37 U1.12
LCD_D5
  Top 0.203: JP4.23 JP4.24 42.55,49.39 41.78,50.16 37.59,50.16 36.02,51.73 36.02,53.33 | TFT1.7 30.06,23.38 34.47,27.78 34.47,40.07 33.49,41.04 32.01,41.04 31.16,41.89 31.16,49.34 29.72,50.79 29.72,55.11 30.35,55.74 35.31,55.74 36.07,54.98 36.07,53.38 36.02,53.33 | 36.02,53.33 U1.14
LCD_D6  (via drill 0.25)
  Top 0.203: v45.09,41.19 JP4.25 JP4.26 45.09,49.14 43.69,50.54 40.17,50.54 38.56,52.15 U1.15 | TFT1.10 v30.48,24.88
  Bottom 0.203: v45.09,41.19 42.55,41.19 31.5,30.15 31.5,25.89 v30.48,24.88
LCD_D7  (via drill 0.25, 0.3)
  Top 0.203: v47.62,41.19 JP4.27 JP4.28 47.62,48.25 45,50.87 41.83,50.87 41.1,51.6 U1.16 | v30.82,29.38 30.77,29.33 29.42,29.33 TFT1.19
  Bottom 0.203: v30.82,29.38 30.82,30.14 42.83,42.15 46.67,42.15 v47.62,41.19
LCD_E  (via drill 0.25)
  Top 0.203: TFT1.5 27.64,22.38 v27.18,21.91 | v27.18,39.95 27.18,43.25 JP4.11 | U1.11 28.4,51.13 27.3,50.03 JP4.12
  Top 0.406: JP4.12 JP4.11
  Bottom 0.203: v27.18,21.91 v27.18,39.95
LCD_GREEN
  Top 0.203: JP4.33 55.24,41.85 56.64,40.46 65.85,40.46 67.73,42.34 69.49,42.34 69.6,42.23 69.6,41.17 IC1.2
  Top 0.406: JP4.34 JP4.33
LCD_NEO  (via drill 0.25)
  Top 0.203: Q5.1 23.62,25.43 23.62,39.19 v24.13,39.69 | v71.12,45.54 70.74,45.92 IC1.6 | U1.17 43.64,51.72 44.11,51.25 45.09,51.25 46.23,50.11 v47.62,50.11
  Bottom 0.203: v24.13,39.69 24.13,41.73 26.92,44.52 46.23,44.52 48.01,46.3 48.01,46.93 | v47.62,50.11 47.62,46.93 48.01,46.93 | v71.12,45.54 68.83,47.82 59.94,47.82 59.05,46.93 48.01,46.93
LCD_RED
  Top 0.203: IC1.1 66.93,41.04 65.84,39.95 54.69,39.95 52.91,41.73 52.91,43.17 JP4.31
  Top 0.406: JP4.31 JP4.32
LCD_RS
  Top 0.203: U1.10 25.86,51.63 24.89,50.66 22.99,50.66 22.23,49.9 JP4.8 | TFT1.8 27.39,23.88 26.9,24.37 23.15,24.37 22.89,24.63 22.89,27.27 23.23,27.62 23.23,40.46 22.23,41.47 JP4.7
  Top 0.406: JP4.8 JP4.7
LEDK
  Top 0.203: R11.1 R14.1 R16.1 R18.1 24.55,27.45 Q5.3
MISO  (via drill 0.25)
  Top 0.203: v98.04,29.03 98.52,29.51 X3.6 | U1.21 52.66,71.48 54.98,71.48 58.73,75.23 66.92,75.23 69.86,78.16 76.51,78.16 76.94,77.73 76.94,76.93 J2.P7 77.08,76.78 77.08,73.49 77.13,73.45 v77.16,73.48
  Bottom 0.203: v98.04,29.03 98.34,29.32 98.34,56.92 81.79,73.48 v77.16,73.48
MOSI  (via drill 0.25)
  Top 0.203: X3.5 97.25,30.01 v96.77,29.53 | U1.25 41.1,75.05 v41.02,75.13 | v72.57,73.53 72.57,74.51 72.58,74.52 72.58,76.89 J2.P3
  Bottom 0.203: v96.77,29.53 96.78,29.54 96.78,31.12 97.68,32.02 97.68,56.43 82.29,71.83 75.31,71.83 73.36,73.78 72.82,73.78 v72.57,73.53 72.57,73.45 72.28,73.74 63.74,73.74 60.94,70.94 49.14,70.94 49.15,70.95 45.2,70.95 v41.02,75.13
N$1  (via drill 0.3)
  Top 0.203: v47.75,37.46 45.21,34.92 45.21,29.46 44.2,28.44 40.77,28.44 40.17,29.04 R25.1 | v67.62,28.12 67.62,28.09 66.41,26.88 U6.16
  Bottom 0.203: v67.62,28.12 66.93,28.82 66.93,29.2 58.29,37.84 48.13,37.84 v47.75,37.46
N$2
  Top 0.203: TFT1.21 28.02,30.38 26.8,29.15 R18.2
N$3
  Top 0.203: TFT1.22 26.45,30.88 R16.2
N$4
  Top 0.203: TFT1.23 27.37,31.38 26.54,32.2 R14.2
N$5
  Top 0.203: TFT1.24 28.64,31.88 26.8,33.72 R11.2
N$6
  Top 0.406: JP4.6 JP4.5 19.69,38.53 19.12,37.97 14.85,37.97 10.85,41.98 6.18,41.98 5.02,40.82 VR1.2
N$7
  Top 0.203: R10.1 88.01,35.97 86.46,34.42 U3.9
N$8  (via drill 0.25, 0.3)
  Top 0.203: R17.1 50.58,29.16 R20.2 50.59,29.1 51.63,29.1 v51.64,29.09 C13.2 | U6.27 61,29.08 59.48,30.6 v58.71,30.6
  Bottom 0.203: v58.71,30.6 53.21,30.6 51.64,29.02 v51.64,29.09
N$11
  Top 0.203: U3.8 86.8,33.92 87.12,34.24 R12.2 R13.1
N$12
  Top 0.203: TX.C 96.86,48.27 95.28,49.85 92.39,49.85 88.52,45.98 88.52,44.54 82.66,38.68 82.66,37.84 U3.19
N$13  (via drill 0.25)
  Top 0.203: v96.52,52.32 96.91,51.92 RX.C | U3.18 83.09,37.87 83.09,38.64 88.85,44.4 88.85,45.84 92.15,49.14 v94.49,49.14
  Bottom 0.203: v94.49,49.14 96.52,51.17 v96.52,52.32
N$15
  Top 0.203: TX.A 97.66,47.52 96.19,47.52 95.26,48.45 91.98,48.45 89.97,46.43 R7.1
N$16
  Top 0.203: RX.A 99.5,52.01 104.94,52.01 105.61,51.34 105.61,45.32 104.94,44.65 101.06,44.65 100.58,45.13 100.58,48.51 99.87,49.22 96.38,49.22 95.41,50.18 91.12,50.18 R6.1
N$17
  Top 0.203: C9.1 50.68,32.71 R15.1 50.78,32.81 57.86,32.81 61.13,29.54 61.25,29.54 61.5,29.29 U6.26
N$19
  Top 0.203: C17.1 72.71,26.79 71.8,25.88 U6.14
N$20
  Top 0.203: C20.1 57.34,22.86 59.35,24.88 U6.34
N$21  (via drill 0.25)
  Top 0.152: ATTACH.C v2.68,31.64 | v12.71,11.51 U8.11
  Bottom 0.152: v2.68,31.64 13.09,31.64 13.58,31.15 13.58,13.03 12.71,12.17 v12.71,11.51
N$22
  Top 0.152: U8.23 14.24,6.54 14.24,5.29 13.84,4.89 C33.1
N$23
  Top 0.203: R24.1 57.55,21.07 58.06,21.59 58.06,22.85 59.59,24.38 U6.35
N$24
  Top 0.152: 55.71,29.99 58.03,29.99
  Top 0.203: R19.2 54.99,30.71 55.71,29.99 | U6.28 60.18,28.18 59.69,28.67 59.34,28.67 58.03,29.99
N$25
  Top 0.152: U8.21 13.24,6.54 13.24,6.18 11.68,4.62 C32.1
N$26
  Top 0.203: R36.1 68.75,30.6 67.18,30.6 65.79,29.2 65.79,27.91 U6.18
N$29
  Top 0.152: 1.5A.C 2.68,18.26 4.76,16.18 4.76,13.86 7.31,11.31 9.55,11.31 10.26,10.6 10.26,10.1 11.11,9.25 U8.14
N$30
  Top 0.152: R21.1 9.78,6.72 10.31,7.25 U8.18
N$31  (via drill 0.25)
  Top 0.152: R27.2 7.96,10.33 | Q6.4 12.79,30.89 12.83,30.85 v12.89,30.92 | R22.1 v9.4,10.53
  Top 0.203: 7.96,10.33 R22.1
  Bottom 0.152: v12.89,30.92 13.3,30.51 13.3,13.29 10.54,10.53 v9.4,10.53
N$32
  Top 0.203: 3.3V.A 98.43,45.08 97.79,44.44 89.36,44.44 88.03,43.11 88.03,42.03 88.01,42.02 R8.1
N$33
  Top 0.203: 5V.A 98.43,41.14 97.74,41.82 89.92,41.82 R9.1
N$34
  Top 0.813: X6.VBUS 69.65,12.75 68.61,11.7 68.61,7.58 69.85,6.34 82.17,6.34 JP7.2
N$35
  Top 0.152: U8.20 12.71,6.15 11.29,4.73 8.53,4.73 7.15,6.11 7.15,7.26 6.74,7.68 5.79,7.68 5.45,8.01 5.45,9.24 5.85,9.64 6.8,9.64 7.08,9.92 7.08,11.15 6.91,11.31 6.21,11.31 3A.C
N$36
  Top 0.152: U8.9 13.71,12.56 14.61,13.46 R28.1
N$37
  Top 0.152: R27.1 9.91,8.63 10.29,8.25 U8.16
  Top 0.203: U8.16
N$38
  Top 0.203: R31.1 ATTACH.A
N$39
  Top 0.152: R32.1 12.7,19.88 13.48,20.66 15.35,20.66 15.51,20.5 15.51,19.19 14.85,18.53 11.65,18.53 10.65,19.53 5.3,19.53 1.5A.A
N$40
  Top 0.152: R33.1 14.73,19.81 13.73,18.81 11.76,18.81 10.77,19.81 2.93,19.81 2.1,18.98 2.1,16.18 2.64,15.63 3.54,15.63 4.17,15 3A.A
N$42
  Top 0.203: Q8.1 80.87,22.58 Q7.3 80.01,19.8 79.5,19.3 78.61,19.3 78.23,19.68 78.23,21.71 77.51,22.43 R35.1
OCS1
  Top 0.203: U6.13 66.58,25.38 66.64,25.31 74.8,25.31 75.53,26.04 75.53,29.02 70.87,33.69 70.87,35.55 70.45,35.97 U5.2
OCS2  (via drill 0.3)
  Top 0.203: U4.2 44.35,34.66 46.97,37.28 46.97,38.06 v47.01,38.1 | U6.17 66.41,27.38 66.97,27.94 66.97,28.78 67.65,29.46 v67.69,29.46
  Bottom 0.203: v47.01,38.1 47.01,38.15 47.03,38.17 58.43,38.17 67.14,29.46 v67.69,29.46
OCS3
  Top 0.203: U6.19 64.96,28.73 64.96,29.22 67.68,31.94 67.68,34.06 68.28,34.66 69.31,34.66 U5.3
PWR1
  Top 0.203: R13.2 90.64,32.54 91.69,31.49 91.69,25.39 90.83,24.52 90.8,24.41 C31.1
  Top 0.508: U7.3 84.01,24.18 | 84.01,24.18 84.24,24.41 C30.1 C31.1 | U5.8 76.14,37.24 76.88,36.5 76.88,33.2 81.18,28.91 81.18,27.17 82.11,26.24 U7.1 82.11,24.18 82.57,23.72 83.55,23.72 84.01,24.18
PWR2  (via drill 0.5)
  Top 0.61: U4.6 36.7,35.93 36.58,35.81 | 36.58,33.39 U4.8
  Top 1.016: X5.VBUS 45.2,15.25 43.18,17.26 43.18,22.34 v41.91,23.61 | v36.7,29.96 36.58,30.09 36.58,33.39 36.58,35.81
  Bottom 1.016: v41.91,23.61 36.7,28.82 v36.7,29.96
PWR3  (via drill 0.5)
  Top 0.813: v80.14,27.39 80.01,27.39 80.01,28.41 74.99,33.43 U5.5
  Bottom 0.813: v80.14,27.39 80.01,27.26 80.01,12.69 81.91,10.79 JP7.1
RESET  (via drill 0.25)
  Top 0.203: v95.31,21.88 v95.31,21.87 96.62,20.56 SW3.P$2 SW3.P$1 | v85.47,60.77 84.17,60.77 81.32,63.62 62.5,63.62 61.52,62.63 58.41,62.63 54.99,59.21 54.99,57.62 54.24,56.87 37.86,56.87 30.61,64.12 30.61,68.39 28.4,70.6 U1.30
  Bottom 0.203: v85.47,60.77 85.47,56.33 92.66,49.14 92.66,24.53 v95.31,21.88
RESET-CP
  Top 0.203: U2.6 73,49.34 73,55.36 71.21,57.15 SW2.S1
RESET-RP2040  (via drill 0.25)
  Top 0.203: SW2.O1 66.21,57.53 65.82,57.92 65.7,57.79 v64.81,57.79 | v23.37,70.21 23.32,70.26 U1.32
  Bottom 0.203: v64.81,57.79 64.81,57.76 63.23,56.18 38.09,56.18 24.06,70.21 v23.37,70.21
RTS
  Top 0.152: U3.24 79.9,35.92 79.63,36.19 79.63,36.86 79.2,37.29
  Top 0.203: U2.1 76.75,44.46 77.4,43.81 U2.5 78.56,43.81 79.2,43.17 79.2,37.29
RXD  (via drill 0.25)
  Top 0.203: SW1.P1 77.85,53.15 v77.85,53.33 | v5.51,56.12 5.51,53.53 U1.2 | v78.1,36.83 v78.11,36.82 78.11,35.96 79.14,34.92 U3.26
  Bottom 0.203: v5.51,56.12 5.76,56.36 15.98,56.36 16.2,56.58 36.76,56.58 37.84,55.49 75.55,55.49 77.71,53.33 v77.85,53.33 78.1,53.09 v78.1,36.83
RXI  (via drill 0.25)
  Top 0.203: X3.11 101.31,27.01 v101.1,26.79 | SW1.S1 74.3,54.21 74.3,57.09 75.73,58.53 80.73,58.53 81.62,57.64 SW1.O2 81.62,53.6 83.48,51.73 91.98,51.73 92.36,51.35 95.18,51.35 96.65,49.88 102.5,49.88 103.49,50.87 JP3.10
  Bottom 0.203: v101.1,26.79 101.1,49.6 102.36,50.87 JP3.10
SCK  (via drill 0.25)
  Top 0.203: v97.54,30.8 97.84,30.51 X3.4 | 74.77,73.7 v74.68,73.6 | U1.24 43.64,71.24 44.3,70.58 67.16,70.58 69.34,72.76 73.84,72.76 v74.68,73.6 | v74.68,73.6 74.68,76.83 J2.P5
  Bottom 0.203: v74.68,73.6 74.68,73.48 75.69,72.46 82.23,72.46 98.01,56.68 98.01,31.28 v97.54,30.8
SCL  (via drill 0.25, 0.35)
  Top 0.152: U8.7 15.39,10.43 v16.74,11.78 18.41,13.46 R29.1
  Top 0.203: v107.7,24.99 107.19,24.99 106.18,26.01 X3.13 | CONN1.4 97.89,76.17 v97.28,76.78 | v22.35,59.76 18.24,55.65 U1.7 18.24,51.92 17.6,51.28 14.87,51.28 12.83,49.25 12.83,43.59 v12.63,43.4
  Top 0.406: CONN1.4 98.32,73.45 100.58,71.19 JP3.2
  Bottom 0.203: JP3.2 107.04,71.19 108.05,70.17 108.05,25.35 v107.7,24.99 | v22.35,59.76 20.95,61.16 20.95,71.5 26.08,76.63 59.29,76.63 60.5,75.41 65.23,75.41 66.45,76.63 97.13,76.63 v97.28,76.78 | v12.63,43.4 12.63,42.13 15.24,39.52 15.24,25.84 16.32,24.76 16.32,12.34 16.96,11.71 16.81,11.71 v16.74,11.78
SD_CD  (via drill 0.25)
  Top 0.203: U1.19 48.72,51.85 49.53,51.05 54.23,51.05 60.83,57.65 v60.96,57.65 | v74.68,65.65 74.7,65.68 J2.P9
  Bottom 0.203: v60.96,57.65 61.01,57.65 69.01,65.65 v74.68,65.65
SD_CS
  Top 0.203: U1.22 48.72,71.48 49.29,70.91 56.4,70.91 R1.2 58.76,73.99 59.52,74.75 70.25,74.75 71.46,75.96 J2.P2
SDA  (via drill 0.25, 0.35)
  Top 0.152: U8.8 14.21,11.1 v15.09,11.98 16.57,13.46 R30.1
  Top 0.203: v107.95,23.69 107.7,23.69 105.88,25.51 X3.14 | v97.79,77.79 98.55,77.79 99.31,77.03 CONN1.3 | v20.57,59.76 15.7,54.89 U1.6 15.7,52.59 12.5,49.38 12.5,44.57 11.58,43.65 v11.58,43.35
  Top 0.406: CONN1.3 99.32,74.99 100.58,73.73 JP3.1
  Bottom 0.203: JP3.1 107.7,73.73 108.46,72.97 108.46,24.2 v107.95,23.69 | v20.57,59.76 20.57,71.7 25.91,77.03 59.35,77.03 60.64,75.74 65.09,75.74 66.39,77.03 96.27,77.03 97.03,77.79 v97.79,77.79 | v15.09,11.98 15.13,11.93 15.95,12.75 15.95,24.67 14.91,25.71 14.91,39.38 12.3,41.99 12.3,42.63 v11.58,43.35
SP
  Top 0.203: SP1.P$2 57.73,59.61 56.64,58.52 56.64,56.94 54.92,55.22 52.99,55.22 U1.20
SWCLK  (via drill 0.25)
  Top 0.203: v106.68,26.57 105.83,26.57 104.9,27.51 X3.10 | JP3.8 101.35,55.95 99.03,58.26 84.81,58.26 82.23,60.84 62.27,60.84 61.47,61.64 58.82,61.64 55.98,58.8 55.98,57.21 54.65,55.88 37.45,55.88 31.81,61.52 19.49,61.52 13.16,55.18 U1.5
  Bottom 0.203: JP3.8 105.46,55.95 105.97,55.44 105.97,34.36 104.75,33.14 104.75,30.82 105.16,30.42 105.16,27.25 105.83,26.57 v106.68,26.57
SWDIO  (via drill 0.25)
  Top 0.203: v106.02,27.61 105.63,28.01 X3.9 | JP3.7 99.27,58.49 99.17,58.59 84.95,58.59 82.37,61.17 62.41,61.17 61.6,61.97 58.69,61.97 55.65,58.93 55.65,57.35 54.51,56.21 37.58,56.21 30.16,63.63 20.88,63.63 19.06,61.81 19.06,61.55 13.26,55.74 11.43,55.74 10.62,54.94 U1.4
  Bottom 0.203: JP3.7 105.61,58.49 106.38,57.73 106.38,34.19 105.22,33.03 105.22,32.39 105.16,32.33 105.16,30.99 105.93,30.22 105.93,28.2 106.02,28.11 v106.02,27.61
TARGET_RESET  (via drill 0.25)
  Top 0.203: X3.8 104.14,28.52 v106.68,28.52 | JP3.6 95.33,61.03 93.22,58.92 85.09,58.92 82.42,61.59 70.1,61.59 69.34,62.35 v68.58,62.35 | SW2.P1 68.32,57.02 v67.44,57.02
  Bottom 0.203: JP3.6 106.78,61.03 106.78,34.02 105.62,32.86 105.62,31.1 106.94,29.78 106.94,28.77 v106.68,28.52 | v67.44,57.02 67.56,57.14 67.56,61.33 v68.58,62.35
TEST
  Top 0.203: X3.16 100.41,24.51 95.58,29.34 95.58,33.34 99.06,36.82 99.06,41.9 97.79,43.17 JP5.3
  Route15 1.778: JP5.3 JP6.1
TXD  (via drill 0.25)
  Top 0.203: SW1.P2 79.12,56.36 v78.83,56.08 | U3.25 79.51,35.42 78.87,36.06 v78.87,36.19 | v5.46,57.52 3,55.06 U1.1
  Bottom 0.203: v5.46,57.52 5.55,57.52 6.38,56.69 15.85,56.69 16.57,57.42 36.39,57.42 37.96,55.85 78.6,55.85 v78.83,56.08 78.87,56.04 v78.87,36.19
TXO  (via drill 0.25)
  Top 0.203: v101.85,25.98 102.38,26.51 X3.12 | SW1.S2 76.62,56.84 81.58,51.88 SW1.O1 82.1,51.4 91.84,51.4 92.22,51.02 95.04,51.02 96.52,49.55 102.41,49.55 JP3.11
  Bottom 0.203: JP3.11 102.87,48.33 101.65,47.11 101.65,45.32 101.81,45.16 101.81,37.65 101.85,37.6 v101.85,25.98
USB1_N  (via drill 0.25)
  Top 0.152: U6.1 61,22.22 60.36,21.58 59.29,21.58 59.15,21.72 v59.18,21.75 | v83.82,31.49 83.64,31.67 U3.5
  Bottom 0.152: v59.18,21.75 59.18,21.6 64.79,21.6 74.3,31.11 82.74,31.11 83.12,31.49 v83.82,31.49
USB1_P  (via drill 0.25)
  Top 0.152: U6.2 61.5,22.22 60.58,21.3 60.2,21.3 59.97,21.07 59.82,21.07 59.69,20.94 v59.69,20.75 | U3.4 83.14,30.75 v83.24,30.65
  Bottom 0.152: v83.24,30.65 83.07,30.83 74.41,30.83 64.91,21.32 60.1,21.32 59.84,21.07 59.82,21.07 59.69,20.94 v59.69,20.75
USB2_N
  Top 0.152: X5.D- 47.7,16.15 48.56,17.01 48.56,17.38 48.82,17.64 60.2,17.64 61.97,19.41 61.97,23.03 U6.3
USB2_P
  Top 0.152: X5.D+ 49.7,16.15 48.84,17.01 48.84,17.26 48.94,17.37 60.31,17.37 62.25,19.3 62.25,22.25 62.53,22.54 62.53,23.03 U6.4
USB3_N
  Top 0.152: U6.6 63.5,22.22 63.61,22.11 63.61,19.43 66.16,16.88 72.64,16.88 72.95,16.57 72.5,16.12 72.15,16.12 X6.D-
USB3_P
  Top 0.152: U6.7 64,22.22 63.89,22.11 63.89,19.55 66.28,17.16 72.76,17.16 73.8,16.12 74.15,16.12 X6.D+
USB4_N  (via drill 0.25)
  Top 0.152: U6.8 64.5,22.22 64.77,21.95 64.77,19.67 v64.75,19.66 | v19.01,66.16 18.63,66.54 18.63,67.61 16.24,69.99 9.72,69.99 7.8,68.07 7.8,65.02 7.31,64.53 3.17,64.53 U1.TP2
  Bottom 0.152: X100.D- 12.87,64.2 11.12,65.95 5.97,65.95 3.81,63.79 3.81,54.6 6.35,52.06 16.91,52.06 19.33,49.64 19.33,16.73 20.7,15.36 64.14,15.36 64.77,15.99 64.77,19.66 v64.75,19.66
  Bottom 0.203: X100.D- 16.07,64.2 16.9,65.03 17.88,65.03 v19.01,66.16
USB4_P  (via drill 0.25)
  Top 0.152: U6.9 65,22.22 65.28,21.94 65.28,20.55 v65.53,20.29 | U1.TP3 4.9,64.25 7.43,64.25 8.08,64.9 8.08,67.96 9.83,69.72 16.13,69.72 18.35,67.49 18.35,66.61 v17.91,66.16
  Bottom 0.152: v65.53,20.29 65.53,19.28 65.05,18.8 65.05,15.88 64.25,15.08 45.72,15.08 20.59,15.08 19.05,16.62 19.05,49.52 16.79,51.78 6.23,51.78 3.53,54.49 3.53,63.9 5.85,66.22 14.16,66.22 X100.D+
  Bottom 0.203: X100.D+ 16.07,66.2 16.9,65.36 17.53,65.36 17.91,65.74 v17.91,66.16
USB_D+
  Top 0.203: X2.D+ 87.27,67.14 87.27,66.38 86.49,65.6 78.83,65.6 77.84,64.61 65.45,64.61 59.87,70.2 38.71,70.2 37.55,71.36 37.55,71.86 U1.26
USB_D-
  Top 0.203: X2.D- 88.88,66.98 87.12,65.22 78.91,65.22 77.98,64.28 65.32,64.28 59.73,69.87 38.43,69.87 37.16,71.14 37.16,71.73 U1.27
VBAT  (via drill 0.25)
  Top 0.203: v106.79,31.82 106.6,32.01 X3.1
  Top 0.406: Q4.3 92.15,56.7 C4.1 98.44,56.04 98.71,56.04 99.57,55.19 v99.57,54.93
  Bottom 0.203: JP3.3 104.39,68.65 106.88,68.65 107.64,67.89 107.64,32.68 v106.79,31.82
  Bottom 0.406: v99.57,54.93 99.57,66.62 101.6,68.65 104.39,68.65
VBAT_SW
  Top 0.203: Q3.1 85.03,57.58 82.1,60.51 62.13,60.51 61.33,61.31 58.96,61.31 56.31,58.66 56.31,57.07 54.78,55.55 37.31,55.55 36.78,56.07 23.83,56.07 23.32,55.57 U1.9
VBUS  (via drill 0.5)
  Top 0.152: 5.97,6.72 5.08,7.61 5.08,10.15 5.46,10.53 R22.2 | U8.24 14.73,6.55 14.73,5.05 C34.1 15.6,3.74 14.62,2.75 9.69,2.75 6.1,6.34 6.1,6.72
  Top 0.203: R21.2 6.1,6.72 5.97,6.72 | 8.64,20.82 9.31,20.15 11.3,20.15 R32.2 R33.2 | v8.64,23.74 8.64,20.82 | 8.64,20.82 8,20.19 2.54,20.19 1.64,19.29 1.64,14.69 5.8,10.53 R22.2 | Q6.1 10.45,32.5 R31.2
  Top 0.305: Q6.1 Q6.2 Q6.3
  Top 0.406: 8.89,28.69 9.4,28.69 9.91,28.69 11.05,27.55 14.48,27.55 14.74,27.29 D2.2
  Top 0.61: J1.A4/B9 8.59,28.52 v8.64,28.57 | J1.B4/A9 7.14,23.74 v8.64,23.74
  Top 0.813: 9.4,28.69 9.22,28.52
  Top 1.27: Q6.2 11.49,31.29 | 9.22,28.52 8.59,28.52
  Top 1.524: 11.49,31.29 8.89,28.69
  Bottom 1.778: v8.64,28.57 v8.64,23.74
VBUS2  (via drill 0.25)
  Top 0.203: C35.1 5.54,74.84 U1.39
  Top 0.813: D1.1 0.89,50.51 0.89,58.41 | 0.89,58.41 0.89,67.05 5.54,71.7 U1.39 | 0.89,58.41 1.14,58.67 14.79,58.67 17.02,60.89 v17.02,61.84
  Bottom 0.813: v17.02,61.84 14.31,61.84 X100.VBUS
VMEAS  (via drill 0.25)
  Top 0.203: JP3.4 98.64,66.11 R2.2 | v106.43,23.69 106.43,24.2 105.62,25.01 X3.15
  Bottom 0.203: JP3.4 106.43,66.11 107.19,65.35 107.19,33.85 106.03,32.69 106.03,31.51 107.44,30.09 107.44,25.98 106.17,24.71 106.17,23.95 v106.43,23.69
VMEAS_DIV2
  Top 0.203: R2.1 R3.2 95.03,61.2 93.08,59.25 85.22,59.25 81.19,63.29 62.64,63.29 61.65,62.3 58.55,62.3 55.32,59.07 55.32,57.48 54.37,56.54 37.72,56.54 30.28,63.98 30.28,66.37 25.86,70.79 U1.31
VUSB
  Top 0.406: C3.1 91.38,65.72 X2.VBUS 91.38,66.04 Q2.3
VUSB_SW
  Top 0.203: Q1.1 83.09,62.32 81.46,63.95 63.46,63.95 58.02,69.39 33.29,69.39 30.94,71.74 U1.29
XTAL1
  Top 0.203: C21.1 45.98,19.23 46.08,19.33 48.13,19.33 X4.P$1 49.78,19.96 51.19,21.37 R23.2 52.08,22.01 52.54,22.01 55.9,25.38 U6.33
XTAL2
  Top 0.203: C18.1 46.03,24.6 48.13,24.6 X4.P$2 50.45,23.96 51.35,23.07 R23.1 52.16,22.34 52.4,22.34 55.87,25.81 60.12,25.81 U6.32

## Text on the board
tPlace: RP2040 Debug Tester | SDA | SCL | Vbat | Vmeas | MicroSD | USB / Host | GND | RP2040 Pico W | Reset | <RP2040/ / CP2102N> | RX/TX / SWAP> | SWDIO | USB4 | SWCLK | #28 | RX | TX | 3V | ---> | 10K | 5V | GND | LCD | USB | 18pin Prog / FPC Cable | USB1 | 16x2 RGB | RP2040 / Reset | 1.5A | 3A | I | USB2 | USB3 | 1.5A | 500mA
bPlace: RP2040 Debug Tester Brains by Elliot Alfirevich, 06/2023 / Adaptation of the RP2040-Based-Tester-Brains-PCB by ladyada | Licenced under Attribution-ShareAlike 3.0 / https://creativecommons.org/licenses/by-sa/3.0/ | NORDIC PPK2 | JLCJLCJLCJLC | /Users/elliot/Dropbox/Projects/Logo/Cockatoo.bmp
bStop: /Users/elliot/Dropbox/Projects/Logo/StopMask.bmp